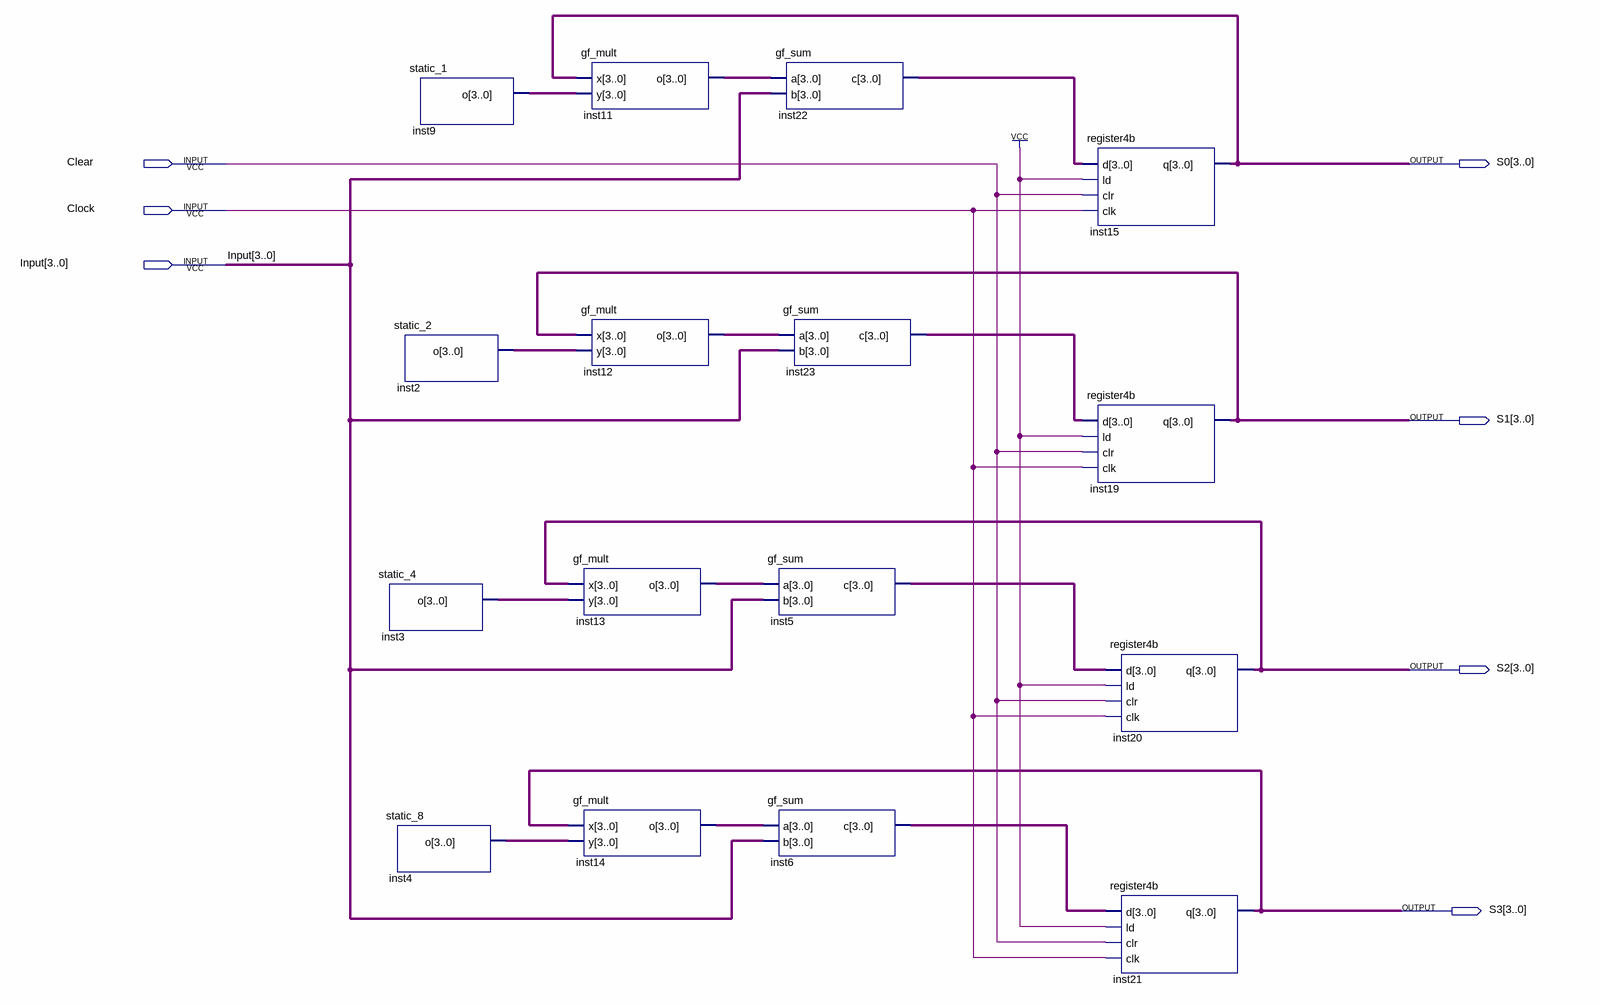
[diagram p0: schematic sheet]
// Quartus schematic RSSyndromeCalc.bdf as structural Verilog: 16 symbols, 7 pins
module RSSyndromeCalc (
  input  Clear,
  input  Clock,
  input  [3:0] Input,
  output [3:0] S0,
  output [3:0] S1,
  output [3:0] S2,
  output [3:0] S3
);

  wire [3:0] inst2_o, inst3_o, inst4_o, inst5_c, inst6_c, inst9_o, inst11_o, inst12_o, inst13_o, inst14_o,
       inst22_c, inst23_c;

  static_2 inst2 (.o(inst2_o));
  static_4 inst3 (.o(inst3_o));
  static_8 inst4 (.o(inst4_o));
  static_1 inst9 (.o(inst9_o));
  gf_mult inst11 (.x(S0), .y(inst9_o), .o(inst11_o));
  gf_mult inst12 (.x(S1), .y(inst2_o), .o(inst12_o));
  gf_mult inst13 (.x(S2), .y(inst3_o), .o(inst13_o));
  gf_mult inst14 (.x(S3), .y(inst4_o), .o(inst14_o));
  gf_sum inst5 (.a(inst13_o), .b(Input), .c(inst5_c));
  gf_sum inst6 (.a(inst14_o), .b(Input), .c(inst6_c));
  gf_sum inst22 (.a(inst11_o), .b(Input), .c(inst22_c));
  gf_sum inst23 (.a(inst12_o), .b(Input), .c(inst23_c));
  register4b inst15 (.d(inst22_c), .ld(1'b1), .clr(Clear), .clk(Clock), .q(S0));
  register4b inst19 (.d(inst23_c), .ld(1'b1), .clr(Clear), .clk(Clock), .q(S1));
  register4b inst20 (.d(inst5_c), .ld(1'b1), .clr(Clear), .clk(Clock), .q(S2));
  register4b inst21 (.d(inst6_c), .ld(1'b1), .clr(Clear), .clk(Clock), .q(S3));
endmodule
